# Altium schematic sheet 131902115-潘怡君-原理图.SCHDOC
size A4
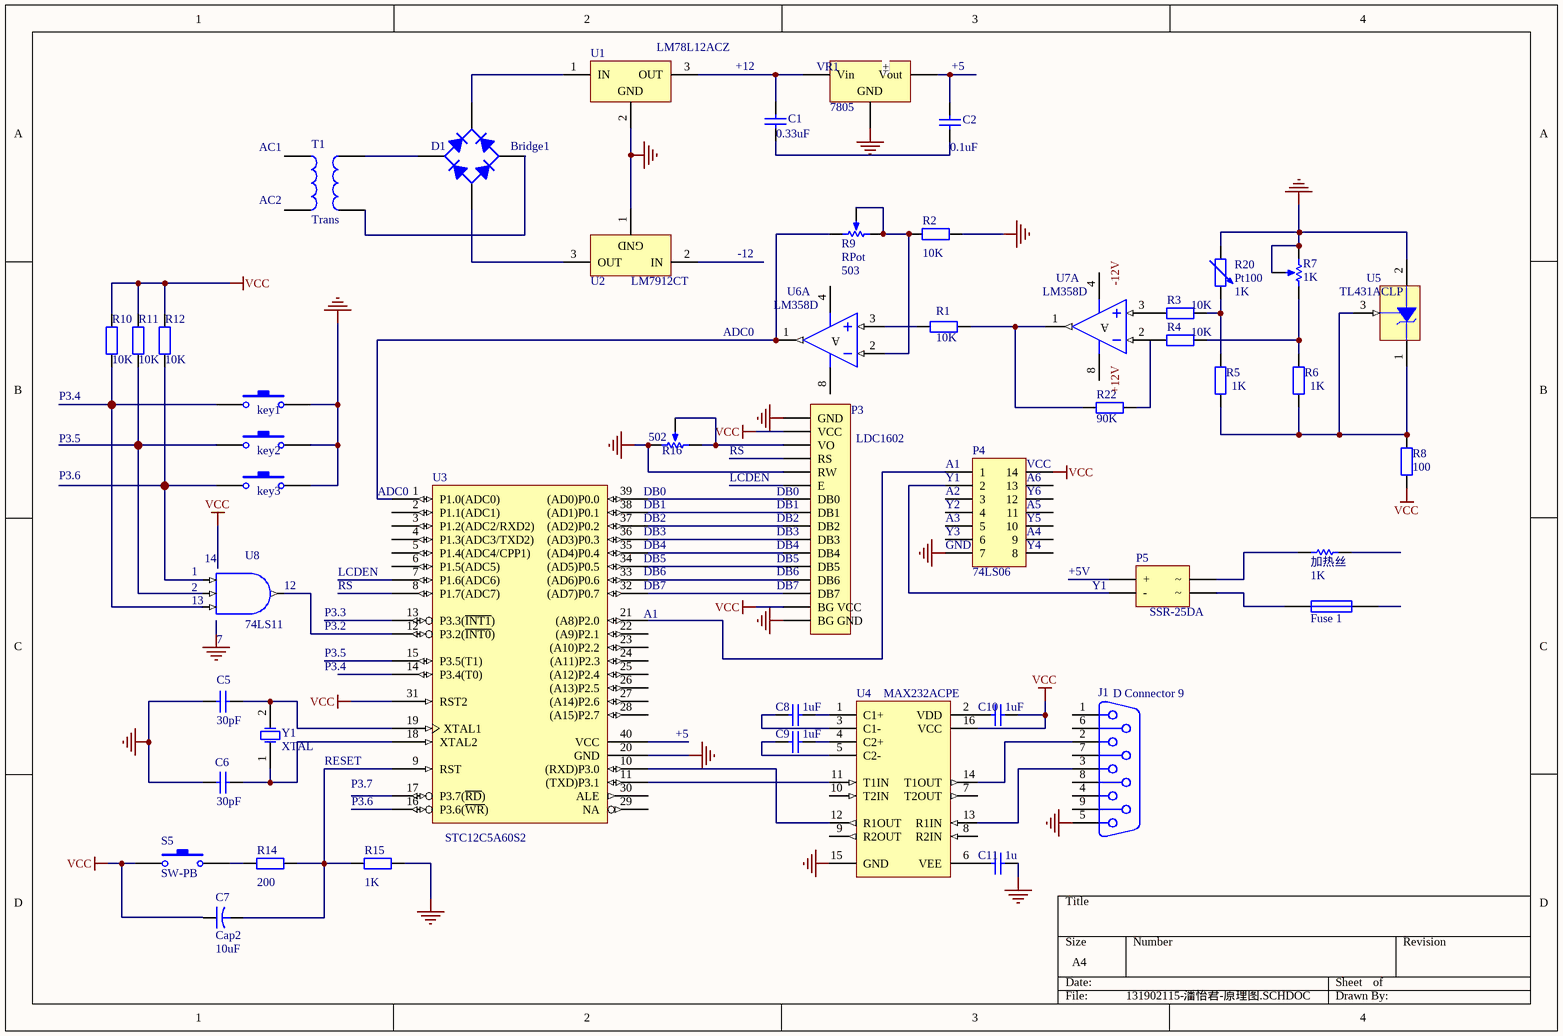
[diagram p0: 131902115-潘怡君-原理图.SCHDOC]

## Parts
C1  value 0.33uF  [CAPR5.08-7.8x3.2]  (hidden comment: Cap)
C2  value 0.1uF  [CAPR5.08-7.8x3.2]  (hidden comment: Cap)
C5  value 30pF  [dianrong]  (hidden comment: Cap)
C6  value 30pF  [dianrong]  (hidden comment: Cap)
C7  Cap2  value 10uF  [dianjiedianrong1/22uF]
C8  value 1uF  [dianrong]
C9  value 1uF  [dianrong]
C10  value 1uF  [dianrong]
C11  value 1u  [dianrong]
D1  Bridge1  [E-BIP-P4/D10]
F?  Fuse 1  [PIN-W2/E2.8]
J1  D Connector 9  [DSUB1.385-2H9]
key1  SW-PB  [anniu]  (value not drawn)
key2  SW-PB  [anniu]  (value not drawn)
key3  SW-PB  [anniu]  (value not drawn)
P3  LDC1602  [LCD 1602]
P4  74LS06  [7406]
P5  SSR-25DA  [ssr]
R1  value 10K  [dianzu]  (hidden comment: Res2)
R2  value 10K  [dianzu]  (hidden comment: Res2)
R3  value 10K  [dianzu]  (hidden comment: Res2)
R4  value 10K  [dianzu]  (hidden comment: Res2)
R5  value 1K  [dianzu]  (hidden comment: Res2)
R6  value 1K  [dianzu]  (hidden comment: Res2)
R7  value 1K  [dianweqi]  (hidden comment: RPot)
R8  value 100  [dianzu]  (hidden comment: Res2)
R9  RPot  value 503  [dianweqi]
R10  value 10K  [dianzu]  (hidden comment: Res2)
R11  value 10K  [dianzu]  (hidden comment: Res2)
R12  value 10K  [dianzu]  (hidden comment: Res2)
R14  value 200  [dianzu]  (hidden comment: Res2)
R15  value 1K  [dianzu]  (hidden comment: Res2)
R16  value 502  [dianweqi]  (hidden comment: RPot)
R20  Pt100  value 1K  [AXIAL-0.6]
R22  value 90K  [dianzu]  (hidden comment: Res2)
R100  加热丝  value 1K  [AXIAL-0.5]
S5  SW-PB  [anniu]
T1  Trans  [TRANS]
U1  LM78L12ACZ  [Z03A]
U2  LM7912CT  [T03B]
U3  STC12C5A60S2  [DIP40 - duplicate]
U4  MAX232ACPE  [MAX232]
U5  TL431ACLP  [tl431]
U6  LM358D  [lm358]  (part A of 2)
U7  LM358D  [lm358]  (part A of 2)
U8  74LS11  [74ls11]
VR1  7805  [PCBComponent_1 - duplicate]
Y1  XTAL  [jingzhen]

## Nets
GND: C5.1 C6.1 C11.2 J1.5 key1.2 key2.2 key3.2 P3.1(GND) P3.5(RW) P3.16(BG_GND) P4.1(7) R2.2 R7.1(TOP) R7.3(TAP) R15.2 R16.2(BOT) U1.2(GND) U2.1(GND) U3.20(GND) U4.15(GND) VR1.2(GND)
VCC: C7.1 C10.2 P3.2(VCC) P3.15(BG_VCC) P4.14 R8.2 R10.2 R11.2 R12.2 S5.1 U3.31(RST2) U4.16(VCC)
NetC1_1: C1.1 C2.1
NetC1_2: C1.2 U1.3(OUT) VR1.1(Vin)
NetC2_2: C2.2 VR1.3(Vout)
NetC5_2: C5.2 U3.19(XTAL1) Y1.2(OSC2)
NetC6_2: C6.2 U3.18(XTAL2) Y1.1(OSC1)
NetC7_2: C7.2 R14.2 R15.1 U3.9(RST)
NetC8_1: C8.1 U4.3(C1-)
NetC8_2: C8.2 U4.1(C1+)
NetC9_1: C9.1 U4.5(C2-)
NetC9_2: C9.2 U4.4(C2+)
NetC10_1: C10.1 U4.2(VDD)
NetC11_1: C11.1 U4.6(VEE)
NetD1_1: D1.1(A) U2.3(OUT)
NetD1_2: D1.2(C) T1.3
NetD1_3: D1.3(K) U1.1(IN)
NetD1_4: D1.4(C) T1.4
NetF?_1: F?.1 P5.4
NetJ1_2: J1.2 U4.14(T1OUT)
NetJ1_3: J1.3 U4.13(R1IN)
Netkey1_1: key1.1 R10.1 U8.I2
Netkey2_1: key2.1 R11.1 U8.I1
Netkey3_1: key3.1 R12.1 U8.I0
NetP3_3: P3.3(VO) R16.1(TOP) R16.3(TAP)
NetP3_7: P3.7(DB0) U3.39((AD0)P0.0)
NetP3_8: P3.8(DB1) U3.38((AD1)P0.1)
NetP3_9: P3.9(DB2) U3.37((AD2)P0.2)
NetP3_10: P3.10(DB3) U3.36((AD3)P0.3)
NetP3_11: P3.11(DB4) U3.35((AD4)P0.4)
NetP3_12: P3.12(DB5) U3.34((AD5)P0.5)
NetP3_13: P3.13(DB6) U3.33((AD6)P0.6)
NetP3_14: P3.14(DB7) U3.32((AD7)P0.7)
NetP4_11: P4.11(2) P5.3(-)
NetP4_13: P4.13(1) U3.21((A8)P2.0)
NetP5_2: P5.2 R100.1
NetR1_1: R1.1 U6.3(IN+)
NetR1_2: R1.2 R22.1 U7.1(OUT)
NetR2_1: R2.1 R9.1(TOP) R9.3(TAP) U6.2(IN-)
NetR3_1: R3.1 U7.3(IN+)
NetR3_2: R3.2 R5.1 R20.2
NetR4_1: R4.1 U7.2(IN-)
NetR4_2: R4.2 R6.1 R7.2(BOT)
NetR5_2: R5.2 R6.2 R8.1 U5.1(K) U5.3(REF)
NetR9_2: R9.2(BOT) U3.1(P1.0(ADC0)) U6.1(OUT)
NetR14_1: R14.1 S5.2
NetR20_1: R20.1 U5.2(A)
NetU3_10: U3.10((RXD)P3.0) U4.12(R1OUT)
NetU3_11: U3.11((TXD)P3.1) U4.11(T1IN)
NetU3_12: U3.12(P3.2(~{INT0})) U8.O

Not connected (* = marked no-connect by the designer): F? 2; J1 1 4 6 7 8 9; P3 4(RS) 6(E); P4 2(8) 3(6) 4(9) 5 6(10) 7(4) 8(11) 9(3) 10(12) 12(13); P5 1(+); R22 2; R100 2; T1 1 2; U2 2(IN); U3 2(P1.1(ADC1)) 3(P1.2(ADC2/RXD2)) 4(P1.3(ADC3/TXD2)) 5(P1.4(ADC4/CPP1)) 6(P1.5(ADC5)) 7(P1.6(ADC6)) 8(P1.7(ADC7)) 13(P3.3(~{INT1})) 14(P3.4(T0)) 15(P3.5(T1)) 16(P3.6(~{WR})) 17(P3.7(~{RD})) 22((A9)P2.1) 23((A10)P2.2) 24((A11)P2.3) 25((A12)P2.4) 26((A13)P2.5) 27((A14)P2.6) 28((A15)P2.7) 29(NA) 30(ALE) 40(VCC); U4 7(T2OUT) 8(R2IN) 9(R2OUT) 10(T2IN); U6 4(V-) 8(V+); U7 4(V-) 8(V+)

## Notes on the sheet
- +12
- (near VR1) ±
- +5
- (near T1) AC1
- (near T1) AC2
- -12
- (near U7) -12V
- ADC0
- P3.5
- P3.4
- +12V
- P3.6
- (near U3) ADC0
- DB1
- DB0
- LCDEN
- (near R16) RS
- (near P3) DB1
- (near P3) DB0
- (near P4) Y2
- (near P4) A2
- (near P4) Y1
- (near P4) A1
- (near P4) VCC
- (near P4) A6
- (near P4) Y6
- (near P4) A5
- (near U8) 1
- (near U8) 14
- (near U3) DB3
- (near U3) DB5
- (near U3) DB2
- (near U3) DB4
- (near U3) DB6
- (near P3) DB3
- (near P3) DB5
- (near P3) DB2
- (near P3) DB4
- (near P3) DB6
- (near P4) GND
- (near P4) Y3
- (near P4) A3
- (near P4) Y5
- (near P4) A4
- (near P4) Y4
- +5V
- (near U8) 2
- (near U8) 13
- (near U8) 7
- (near U8) 12
- P3.3
- P3.2
- RS
- (near U3) DB7
- (near U3) A1
- (near P3) DB7
- (near P5) Y1
- RESET
- P3.7
- (in symbol LM358D, part A) A

## Library data of the parts
C1 C2 C5 C6 C8-C11 = Cap: Capacitor; Published: 8-Jun-2000; LatestRevisionDate: 17-Jul-2002; LatestRevisionNote: Re-released for DXP Platform.; Publisher: Altium Limited
C7 = Cap2: Capacitor; Published: 23-Sep-2002; Publisher: Altium Limited
D1 = Bridge1: Full Wave Diode Bridge; Published: 8-Jun-2000; LatestRevisionDate: 17-Jul-2002; LatestRevisionNote: Re-released for DXP Platform.; Publisher: Altium Limited
F? = Fuse 1: Fuse; Published: 8-Jun-2000; LatestRevisionDate: 17-Jul-2002; LatestRevisionNote: Re-released for DXP Platform.; Publisher: Altium Limited
J1 = D Connector 9: Receptacle Assembly, 9 Position, Right Angle; PackageDocument: O; Positions: 9; Published: 15-Jun-2001; LatestRevisionDate: 17-Jul-2002; LatestRevisionNote: Re-released for DXP Platform.; DatasheetDocument: 1-Sep-1999; PackageReference: 788750; Publisher: Altium Limited; Orientation: Right Angle; Gender: Receptacle
key1-key3 S5 = SW-PB: Switch; Published: 24-Mar-1999; LatestRevisionDate: 17-Jul-2002; LatestRevisionNote: Re-released for DXP Platform.; Publisher: Altium Limited
P3 = Header 16: Header, 16-Pin; LatestRevisionDate: 17-Jul-2002; LatestRevisionNote: Re-released for DXP Platform.; Publisher: Altium Limited
P4 = Header 7X2: Header, 7-Pin, Dual row; LatestRevisionDate: 17-Jul-2002; LatestRevisionNote: Re-released for DXP Platform.; Publisher: Altium Limited
P5 = Header 2X2: Header, 2-Pin, Dual row; LatestRevisionDate: 17-Jul-2002; LatestRevisionNote: Re-released for DXP Platform.; Publisher: Altium Limited
R1-R6 R8 R10-R12 R14 R15 R22 = Res2: Resistor; Published: 8-Jun-2000; LatestRevisionDate: 17-Jul-2002; LatestRevisionNote: Re-released for DXP Platform.; Publisher: Altium Limited
R7 R9 R16 = RPot: Potentiometer; Sim Note: Enter the Resistance value and the set point into parameter fields.; Set Position: 0.5; Published: 8-Jun-2000; LatestRevisionDate: 17-Jul-2002; LatestRevisionNote: Re-released for DXP Platform.; Publisher: Altium Limited
R20 = Res Adj2: Variable Resistor; Set Position: 0.5; Published: 8-Jun-2000; LatestRevisionDate: 17-Jul-2002; LatestRevisionNote: Re-released for DXP Platform.; Publisher: Altium Limited
R100 = Res Semi: Semiconductor Resistor; Published: 8-Jun-2000; LatestRevisionDate: 17-Jul-2002; LatestRevisionNote: Re-released for DXP Platform.; Publisher: Altium Limited
T1 = Trans: Transformer; Published: 24-Mar-1999; LatestRevisionDate: 17-Jul-2002; LatestRevisionNote: Re-released for DXP Platform.; Publisher: Altium Limited
U1 = LM78L12ACZ: 3-Terminal Positive Regulator; PackageDocument: 2000; Published: 15-Apr-2002; DatasheetDocument: Sep-1999; PackageReference: Z03A; Publisher: Altium Limited
U2 = LM7912CT: 3-Terminal Negative Regulator; PackageDocument: 1995; Note: Tab is connected to Input; Published: 15-Apr-2002; DatasheetDocument: Jun-1999; PackageReference: T03B; Publisher: Altium Limited
U3 = AT89C52: 8-Bit Microcontroller with 8K Flash ROM
U4 = MAX232ACPE: +5V Powered, Multi-Channel RS-232 Driver/Receiver; PackageDocument: 1997; Published: 16-Jan-2001; LatestRevisionDate: 17-Jul-2002; LatestRevisionNote: Re-released for DXP Platform.; PackageReference: PE16A; Publisher: Altium Limited; Code_JEDEC: MS-001-BB
U5 = TL431ACLP: Programmable Precision Reference; PackageDocument: 1996; Published: 15-Apr-2002; DatasheetDocument: 1999; PackageReference: 29-04; Publisher: Altium Limited
U6 U7 = LM358D: Dual Low-Power Operational Amplifier; Published: 24-Aug-2001; LatestRevisionDate: 17-Jul-2002; LatestRevisionNote: Re-released for DXP Platform.; PackageDocument: Jul-1998; PackageReference: SO8; Publisher: Altium Limited; Code_JEDEC: MS-012-AA; Code_IPC: SO8
U8 = AND3: 3-Input AND Gate, Single Pin Version; XilinxEquivalent: AND3; FunctionalClass: Logic Primitive; PortSize: 3; ArchiveName: GENERIC; VHDLIB_SIM: GENERIC_LIB; Published: 29-Jan-2004; Publisher: Altium Limited; LastRevisionNo: 1.00.00; HelpURL: CR0118 FPGA Generic Library Guide.pdf#page=113; ComponentLink1URL: CR0136 FPGA Logic Primitive Resource Usage.pdf#page=23; ComponentLink1Description: Core &Resource Usage; SubClass: AND; PortStyle: Single Pin Version
VR1 = Volt Reg: Voltage Regulator; Published: 24-Mar-1999; LatestRevisionDate: 17-Jul-2002; LatestRevisionNote: Re-released for DXP Platform.; Publisher: Altium Limited; Code_JEDEC: SMD-220
Y1 = XTAL: Crystal Oscillator; Published: 8-Jun-2000; LatestRevisionDate: 17-Jul-2002; LatestRevisionNote: Re-released for DXP Platform.; Publisher: Altium Limited